# EAGLE design 14k50 (EAGLE 5.06)
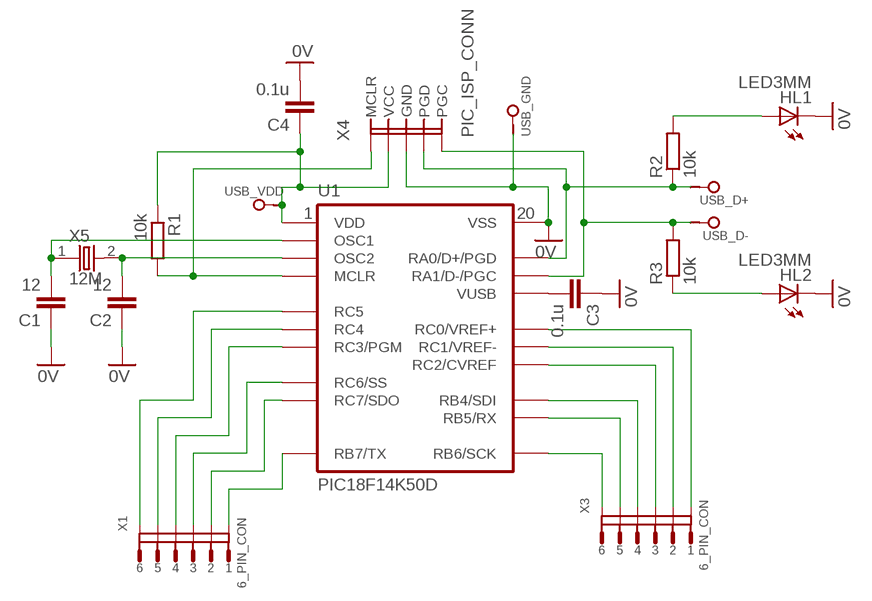
[diagram p0: schematic, sheet 1]

## Parts
C1  12  C0805  [C0805D]
C2  12  C0805  [C0805D]
C3  0.1u  C0805  [C0805D]
C4  0.1u  C0805  [C0805D]
HL1  LED3MM  [LED3MM]
HL2  LED3MM  [LED3MM]
R1  10k  R0805  [R0805D]
R2  10k  R0805  [R0805D]
R3  10k  R0805  [R0805D]
U1  PIC18F14K50D  [SO20-DW]
USB_D+  1_PIN_CON  [1_PIN_CON]
USB_D-  1_PIN_CON  [1_PIN_CON]
USB_GND  1_PIN_CON  [1_PIN_CON]
USB_VDD  1_PIN_CON  [1_PIN_CON]
X1  6_PIN_CON  [6_IN_PINS]
X3  6_PIN_CON  [6_IN_PINS]
X4  PIC_ISP_CONN  [PLC-5PIN]
X5  12M  HC49/S  [HC49/S]

## Nets
0V: C1.1 C2.1 C3.1 C4.2 HL1.K(C) HL2.K(C) U1.1.20(VSS) USB_GND.P$1 X4.P$3(GND)
N$1: HL1.A R2.P$2
N$2: C1.2 U1.1.2(OSC1) X5.1
N$3: R1.P$2 U1.1.4(MCLR) X4.P$1(MCLR)
N$4: C2.2 U1.1.3(OSC2) X5.2
N$5: U1.1.5(RC5) X1.P$6
N$6: HL2.A R3.P$1
N$7: R2.P$1 U1.1.19(RA0/D+/PGD) USB_D+.P$1 X4.P$4(PGD)
N$8: R3.P$2 U1.1.18(RA1/D-/PGC) USB_D-.P$1 X4.P$5(PGC)
N$9: C3.2 U1.1.17(VUSB)
N$10: U1.1.6(RC4) X1.P$5
N$11: U1.1.7(RC3/PGM) X1.P$4
N$12: U1.1.8(RC6/SS) X1.P$3
N$13: U1.1.9(RC7/SDO) X1.P$2
N$14: U1.1.10(RB7/TX) X1.P$1
N$15: U1.1.11(RB6/SCK) X3.P$6
N$16: U1.1.12(RB5/RX) X3.P$5
N$17: U1.1.13(RB4/SDI) X3.P$4
N$18: U1.1.14(RC2/CVREF) X3.P$3
N$19: U1.1.15(RC1/VREF-) X3.P$2
N$20: U1.1.16(RC0/VREF+) X3.P$1
VDD: C4.1 R1.P$1 U1.1.1(VDD) USB_VDD.P$1 X4.P$2(VCC)

## Library data of the parts
C1-C4 = den:C0805
HL1 HL2 = den:LED3MM
R1-R3 = den:R0805
U1 = Dmitry:PIC18F14K50: L6205* DMOS DUAL FULL BRIDGE DRIVER Cases: L6205N (PowerDIP20), L6205D (PowerSO20) Author: Dipl.-Ing. FH Rainer Bayer, rainer.bayer@hs-heilbronn.de, www.ing-rb.de/hhn Notes: 1. ENA, ENB pin direction "I/O": see data sheet (ENA and ENB pins open collector driving vs. push-pull driving) 2. SENSEA, SENSEB pin direction "PWR": see data sheet (power ground)
USB_D+ USB_D- USB_GND USB_VDD = Dmitry:1_PIN_CON
X1 X3 = Dmitry:6_PIN_CON
X4 = den:PIC_ISP_CONN
X5 = den:HC49/S

## Board
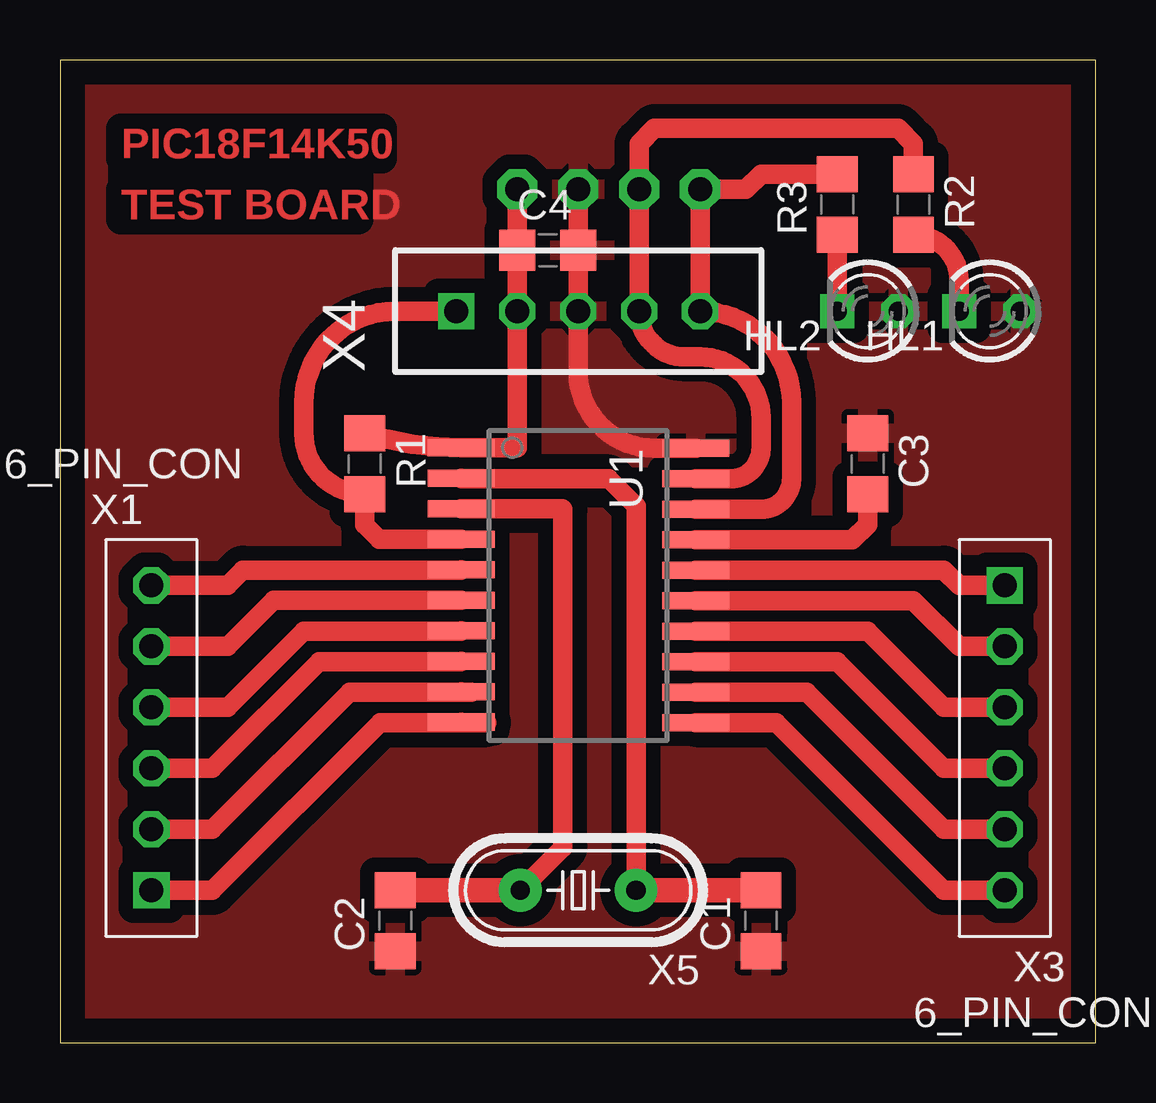
[diagram p1: board, top side]

Size 43.16 x 40.95 mm. Coordinates in mm from the lower left corner, seen from the top.
Outline: 0,0 43.16,0 43.16,40.95 0,40.95 0,0
Copper layers (1*16): Top 0.035mm / dielectric 1.5mm / Bottom 0.035mm
Design rules "DMITRY": minimum track width 10mil, minimum drill 24mil, track to track 8mil, track to pad 8mil, pad to pad 8mil, via to via 8mil, smd to smd 8mil, copper to edge 40mil, drill to drill 8mil, minimum pad ring 10mil, minimum via ring 8mil, stop-mask expansion 4mil, vias tented up to drill 0mil, thermal gap 10mil

### Footprints (pad centres in the part's own frame; a part is rotated, then mirrored left to right if it is on the bottom)
C0805D = smd 1.5 x 1.7: 1 -1.27,0; 2 1.27,0
LED3MM = drill 0.8 pad 1.422 square: A 1.27,0 | drill 0.8 pad 1.422 octagon: K -1.27,0
R0805D = smd 1.5 x 1.7: P$1 -1.27,0; P$2 1.27,0
SO20-DW = smd 0.6 x 2.2: 1 -5.715,-4.6; 2 -4.445,-4.6; 3 -3.175,-4.6; 4 -1.905,-4.6; 5 -0.635,-4.6; 6 0.635,-4.6; 7 1.905,-4.6; 8 3.175,-4.6; 9 4.445,-4.6; 10 5.715,-4.6; 11 5.715,4.6; 12 4.445,4.6; 13 3.175,4.6; 14 1.905,4.6; 15 0.635,4.6; 16 -0.635,4.6; 17 -1.905,4.6; 18 -3.175,4.6; 19 -4.445,4.6 | smd 0.711 x 2.794: 1.1 -5.74,-4.874; 1.2 -4.47,-4.874; 1.3 -3.2,-4.874; 1.4 -1.93,-4.874; 1.5 -0.66,-4.874; 1.6 0.61,-4.874; 1.7 1.88,-4.874; 1.8 3.15,-4.874; 1.9 4.42,-4.874; 1.10 5.69,-4.874; 1.11 5.715,4.905; 1.12 4.445,4.905; 1.13 3.175,4.905; 1.14 1.905,4.905; 1.15 0.635,4.905; 1.16 -0.635,4.905; 1.17 -1.905,4.905; 1.18 -3.175,4.905; 1.19 -4.445,4.905; 1.20 -5.715,4.905
1_PIN_CON = drill 1 pad 1.676 octagon: P$1 0,0
6_IN_PINS = drill 1 pad 1.422 square: P$1 0,0 | drill 1 pad 1.422 octagon: P$2 2.54,0; P$3 5.08,0; P$4 7.62,0; P$5 10.16,0; P$6 12.7,0
PLC-5PIN = drill 1 square: P$1 0,5.08 | drill 1 octagon: P$2 0,2.54; P$3 0,0; P$4 0,-2.54; P$5 0,-5.08
HC49/S = drill 0.8 pad 1.778 round: 1 -2.413,0; 2 2.413,0

### Placement (x,y rotation side)
C1  29.21,5.08 90 top
C2  13.97,5.08 90 top
C3  33.66,24.13 270 top
C4  20.32,33.02 0 top
HL1  38.73,30.48 180 top
HL2  33.66,30.48 180 top
R1  12.7,24.13 270 top
R2  35.56,34.93 270 top
R3  32.38,34.93 90 top
U1  21.59,19.05 270 top
USB_D+  24.13,35.56 0 top
USB_D-  26.67,35.56 0 top
USB_GND  21.59,35.56 0 top
USB_VDD  19.05,35.56 0 top
X1  3.81,6.35 90 top
X3  39.37,19.05 270 top
X4  21.59,30.48 90 top
X5  21.59,6.35 180 top

### Tracks (layer width: path | path; a pad name or v marks a point on that pad's centre or on a via)
0V
  Top 0.813: U1.1.20 24.77,24.77 arc-90 21.59,27.94 X4.P$3 USB_GND.P$1
  pour Top (isolate 0.61): 0,40.64 43.18,40.64 43.18,0 0,0
N$1
  Top 0.813: R2.P$2 arc-90 37.46,31.75 HL1.A
N$2
  Top 0.813: X5.1 24,22.35 22.86,23.5 16.74,23.5 U1.1.2
  Top 1.016: X5.1 C1.2
N$3
  Top 0.813: U1.1.4 13.31,20.98 12.7,21.59 R1.P$2 arc-90 10.16,25.4 10.16,26.67 arc-90 13.97,30.48 X4.P$1
N$4
  Top 0.813: X5.2 20.95,8.13 20.95,22.23 20.93,22.25 U1.1.3
  Top 1.016: C2.2 X5.2
N$5
  Top 0.813: X1.P$6 6.98,19.05 7.62,19.69 16.69,19.69 U1.1.5
N$6
  Top 0.813: HL2.A R3.P$1
N$7
  Top 0.813: U1.1.19 27.94,23.5 arc90 29.21,24.77 29.21,26.04 arc90 26.67,28.57 26.03,28.57 arc-90 X4.P$4 USB_D+.P$1 24.13,37.46 24.77,38.1 34.92,38.1 35.56,37.46 R2.P$1
N$8
  Top 0.813: U1.1.18 29.21,22.23 arc90 30.48,23.5 30.48,26.67 arc90 X4.P$5 USB_D-.P$1 28.57,35.56 29.21,36.2 R3.P$2
N$9
  Top 0.813: U1.1.17 33.02,20.96 33.66,21.59 C3.2
N$10
  Top 0.813: U1.1.6 8.91,18.44 6.98,16.51 X1.P$5
N$11
  Top 0.813: X1.P$4 6.98,13.97 10.16,17.15 16.69,17.15 U1.1.7
N$12
  Top 0.813: X1.P$3 6.35,11.43 10.8,15.88 16.69,15.88 U1.1.8
N$13
  Top 0.813: X1.P$2 6.35,8.89 12.06,14.61 16.74,14.61 | 16.74,14.61 17.14,14.61 | 16.74,14.61 U1.1.9
N$14
  Top 0.813: X1.P$1 6.35,6.35 13.33,13.34 16.74,13.34 | 16.74,13.34 17.78,13.34 | 16.74,13.34 U1.1.10
N$15
  Top 0.813: U1.1.11 29.84,13.34 36.83,6.35 X3.P$6
N$16
  Top 0.813: X3.P$5 36.83,8.89 31.11,14.61 U1.1.12
N$17
  Top 0.813: X3.P$4 36.83,11.43 32.38,15.88 U1.1.13
N$18
  Top 0.813: X3.P$3 36.83,13.97 33.66,17.15 U1.1.14
N$19
  Top 0.813: X3.P$2 37.46,16.51 35.56,18.41 U1.1.15
N$20
  Top 0.813: X3.P$1 37.46,19.05 36.83,19.69 U1.1.16
VDD
  Top 0.813: USB_VDD.P$1 C4.1 X4.P$2 19.05,24.79 U1.1.1 arc-17 R1.P$1

### Text on the board
Top: PIC18F14K50 | TEST BOARD